# Altium schematic sheet Linelance_Schematic_page3.SchDoc
size 420 x 297 mm; Address1: Address1; Address2: Address2; Address3: Address3; Address4: Address4; DocumentNumber: АБВГ.123456.001 Э3; SheetNumber: 1; SheetTotal: 3; Scale: 1:1; DocumentType: Схема электрическая принципиальная; FirstReferrence: АБВГ.123456.001
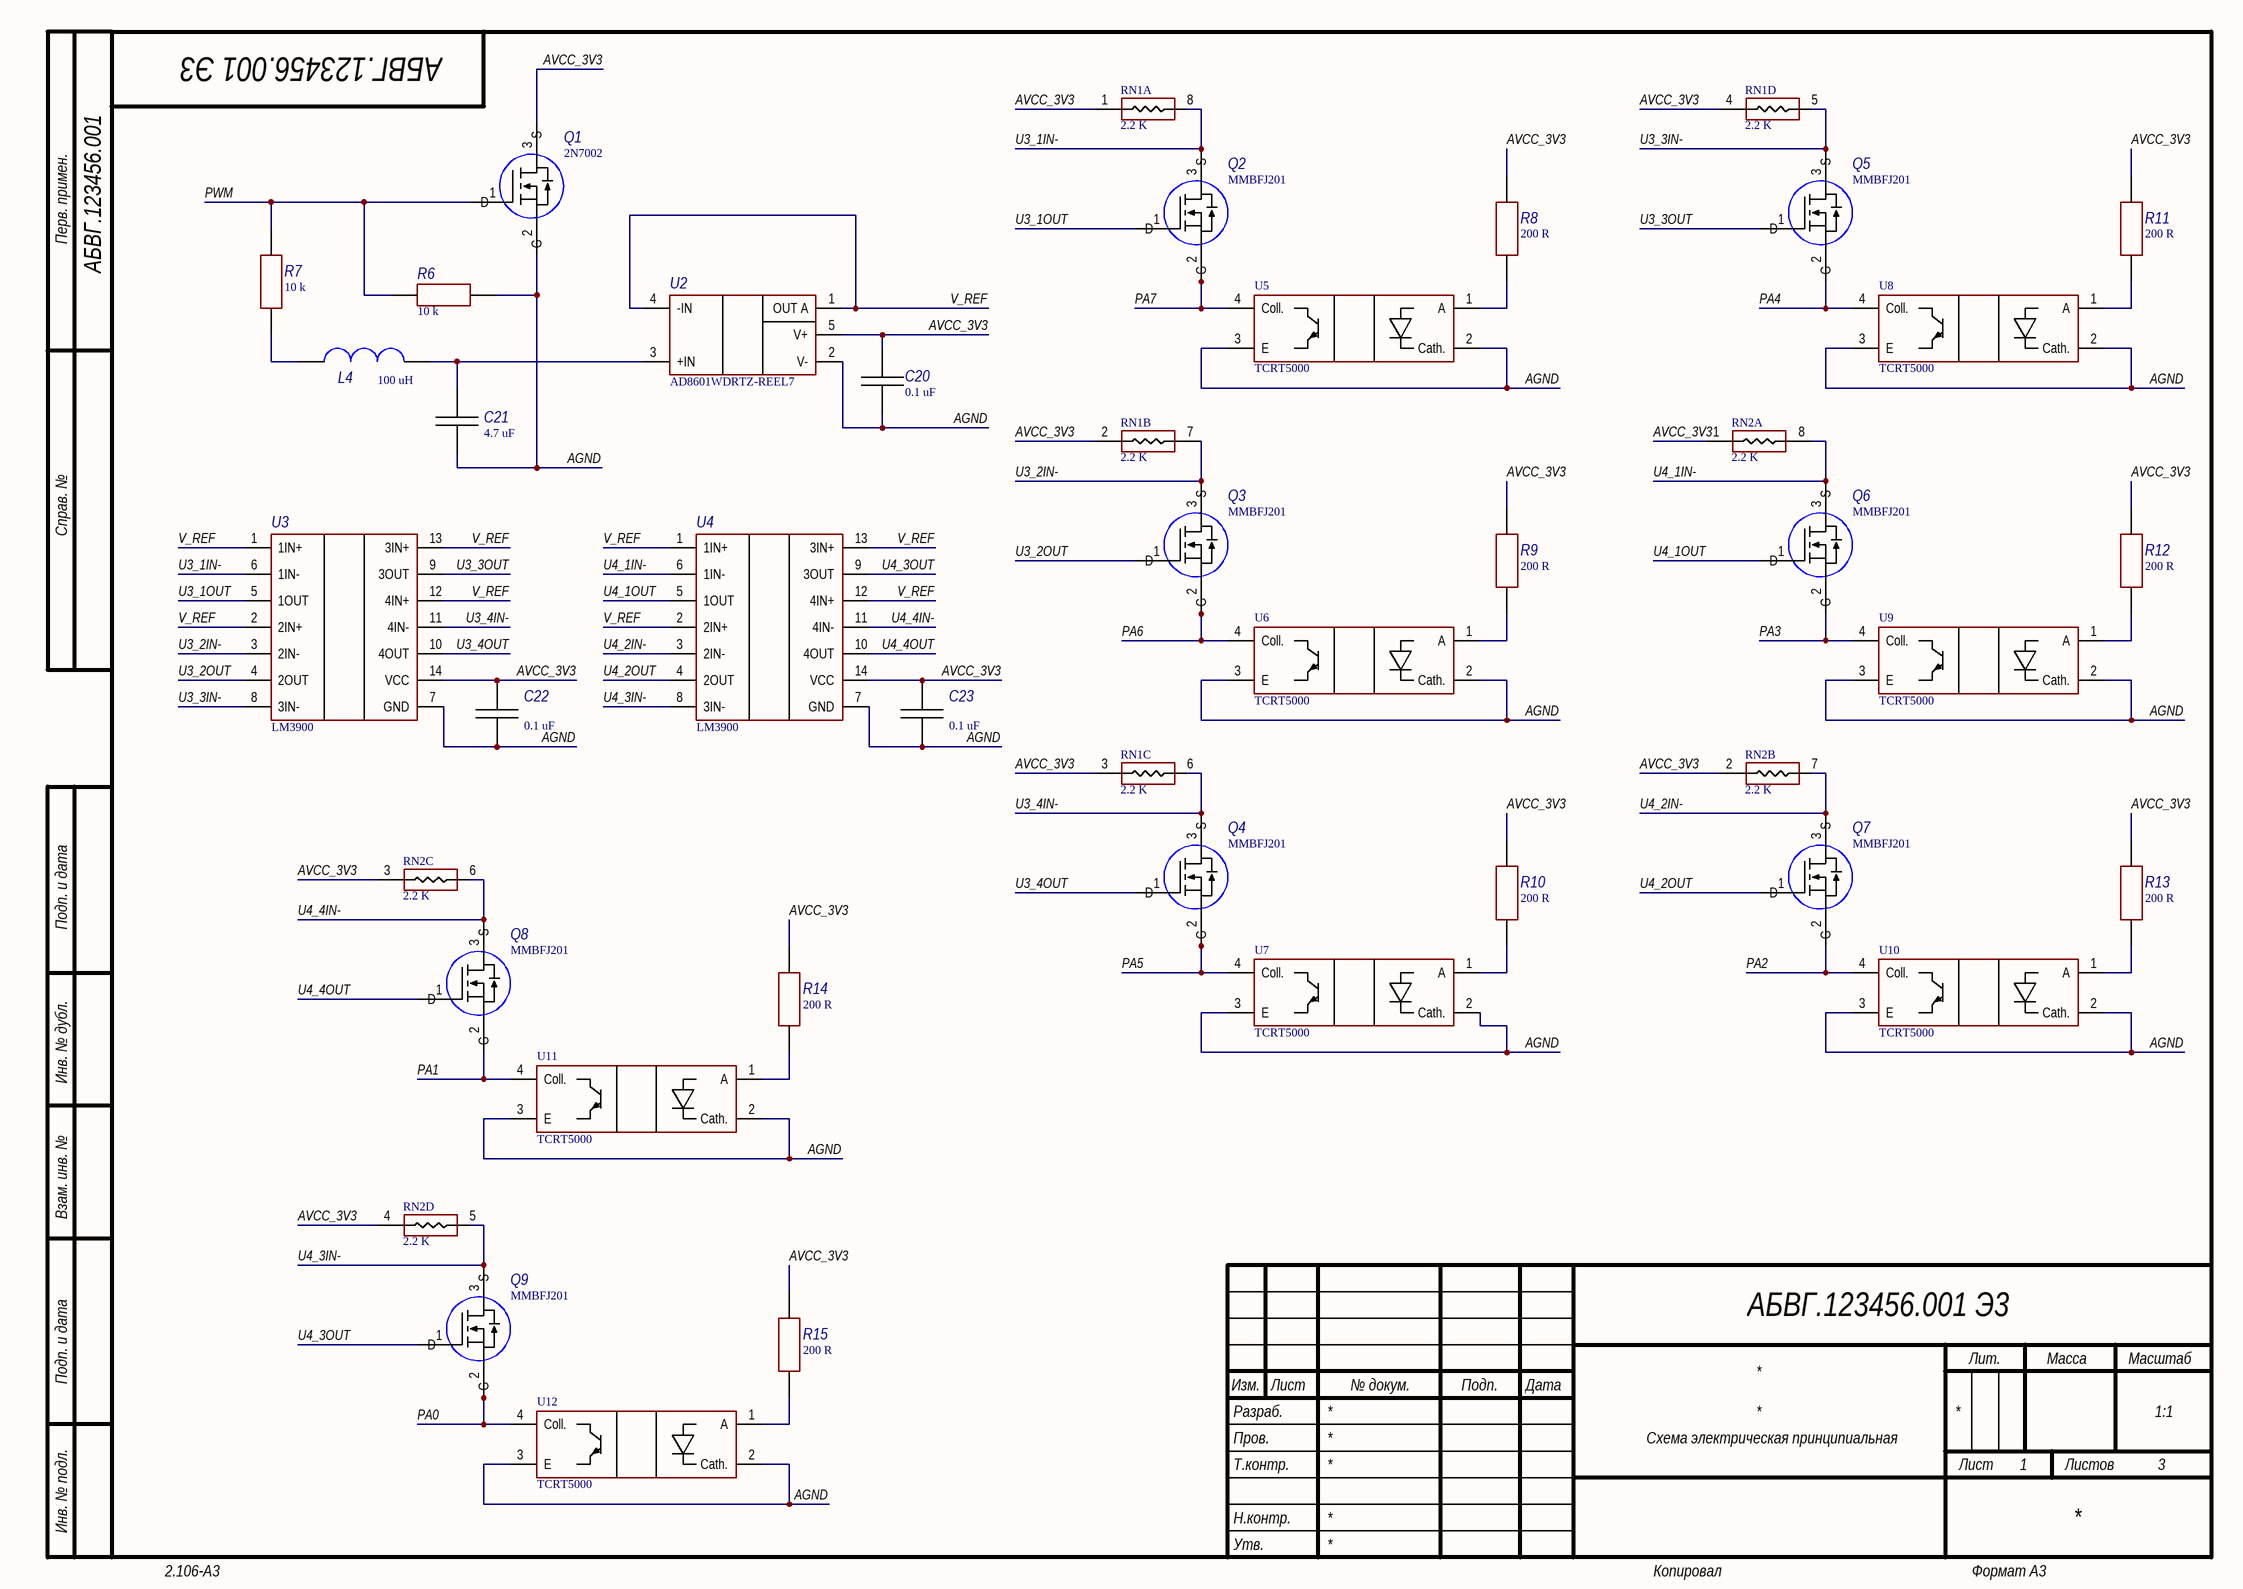
[diagram p0: Linelance_Schematic_page3.SchDoc]

## Parts
C20  0.1 uF  [C0603]
C21  4.7 uF  [C0603]
C22  0.1 uF  [C0603]
C23  0.1 uF  [C0603]
L4  100 uH  [IND1206]
Q1  2N7002  [SOT-23-3]
Q2  MMBFJ201  [SOT-23-3]
Q3  MMBFJ201  [SOT-23-3]
Q4  MMBFJ201  [SOT-23-3]
Q5  MMBFJ201  [SOT-23-3]
Q6  MMBFJ201  [SOT-23-3]
Q7  MMBFJ201  [SOT-23-3]
Q8  MMBFJ201  [SOT-23-3]
Q9  MMBFJ201  [SOT-23-3]
R6  10 k  [R0603]
R7  10 k  [R0603]
R8  200 R  [R0603]
R9  200 R  [R0603]
R10  200 R  [R0603]
R11  200 R  [R0603]
R12  200 R  [R0603]
R13  200 R  [R0603]
R14  200 R  [R0603]
R15  200 R  [R0603]
RN1  2.2 K  [RN_YC164-JR-072K2L]  (parts A,B,C,D of 4)  (graphical)
RN2  2.2 K  [RN_YC164-JR-072K2L]  (parts A,B,C,D of 4)  (graphical)
U2  AD8601WDRTZ-REEL7  [SOT-23-5]
U3  LM3900  [SOIC-14]
U4  LM3900  [SOIC-14]
U5  TCRT5000  [TCRT5000]
U6  TCRT5000  [TCRT5000]
U7  TCRT5000  [TCRT5000]
U8  TCRT5000  [TCRT5000]
U9  TCRT5000  [TCRT5000]
U10  TCRT5000  [TCRT5000]
U11  TCRT5000  [TCRT5000]
U12  TCRT5000  [TCRT5000]

## Nets
AGND: C20.2 C21.2 C22.2 C23.2 Q1.2(G) R6.2 U2.2(V-) U3.7(GND) U4.7(GND) U5.2(Cath.) U5.3(E) U6.2(Cath.) U6.3(E) U7.2(Cath.) U7.3(E) U8.2(Cath.) U8.3(E) U9.2(Cath.) U9.3(E) U10.2(Cath.) U10.3(E) U11.2(Cath.) U11.3(E) U12.2(Cath.) U12.3(E)
AVCC_3V3: C20.1 C22.1 C23.1 Q1.3(S) R8.2 R9.2 R10.2 R11.2 R12.2 R13.2 R14.2 R15.2 RN1.1 RN1.2 RN1.3 RN1.4 RN2.1 RN2.2 RN2.3 RN2.4 U2.5(V+) U3.14(VCC) U4.14(VCC)
PA0: Q9.2(G) U12.4(Coll.)
PA1: Q8.2(G) U11.4(Coll.)
PA2: Q7.2(G) U10.4(Coll.)
PA3: Q6.2(G) U9.4(Coll.)
PA4: Q5.2(G) U8.4(Coll.)
PA5: Q4.2(G) U7.4(Coll.)
PA6: Q3.2(G) U6.4(Coll.)
PA7: Q2.2(G) U5.4(Coll.)
PWM: Q1.1(D) R6.1 R7.2
U3_1IN-: Q2.3(S) RN1.8 U3.6(1IN-)
U3_1OUT: Q2.1(D) U3.5(1OUT)
U3_2IN-: Q3.3(S) RN1.7 U3.3(2IN-)
U3_2OUT: Q3.1(D) U3.4(2OUT)
U3_3IN-: Q5.3(S) RN1.5 U3.8(3IN-)
U3_3OUT: Q5.1(D) U3.9(3OUT)
U3_4IN-: Q4.3(S) RN1.6 U3.11(4IN-)
U3_4OUT: Q4.1(D) U3.10(4OUT)
U4_1IN-: Q6.3(S) RN2.8 U4.6(1IN-)
U4_1OUT: Q6.1(D) U4.5(1OUT)
U4_2IN-: Q7.3(S) RN2.7 U4.3(2IN-)
U4_2OUT: Q7.1(D) U4.4(2OUT)
U4_3IN-: Q9.3(S) RN2.5 U4.8(3IN-)
U4_3OUT: Q9.1(D) U4.9(3OUT)
U4_4IN-: Q8.3(S) RN2.6 U4.11(4IN-)
U4_4OUT: Q8.1(D) U4.10(4OUT)
V_REF: U2.1(OUT_A) U2.4(-IN) U3.1(1IN+) U3.2(2IN+) U3.12(4IN+) U3.13(3IN+) U4.1(1IN+) U4.2(2IN+) U4.12(4IN+) U4.13(3IN+)
NetC21_1: C21.1 L4.2 U2.3(+IN)
NetL4_1: L4.1 R7.1
NetR8_1: R8.1 U5.1(A)
NetR9_1: R9.1 U6.1(A)
NetR10_1: R10.1 U7.1(A)
NetR11_1: R11.1 U8.1(A)
NetR12_1: R12.1 U9.1(A)
NetR13_1: R13.1 U10.1(A)
NetR14_1: R14.1 U11.1(A)
NetR15_1: R15.1 U12.1(A)

## Notes on the sheet
- Перв. примен.
- Справ. №
- Подп. и дата
- Инв. № дубл.
- Взам. инв. №
- Разраб.
- Изм.
- Лист
- № докум.
- Подп.
- Дата
- Лит.
- Масса
- Масштаб
- Пров.
- Т.контр.
- Листов
- Инв. № подл.
- Утв.
- Н.контр.
- 2.106-A3
- Копировал
- Формат А3

## Library data of the parts
C20 C22 C23 = Capasitor: Manufacturer: Murata Manufacturing; Model: X7R 10% 50V; Value: 0.1 uF; Case: С0603; HelpURL: https://www.chipdip.by/product/grm188r71h104k
C21 = Capasitor: Manufacturer: Murata Manufacturing; Model: X5R 10% 10V; Value: 4.7 uF; Case: С0603; HelpURL: https://www.chipdip.by/product0/9000193550
L4 = Inductivity: Manufacturer: Murata Manufacturing; Model: *; HelpURL: https://www.chipdip.by/product/lqh31cn101k03l; Case: IND1206; Value: 100 uH
Q1 = 2N7002: MOSFET N-Channel 60V 115mA (Ta) 200mW (Ta) Surface Mount SOT-23 (TO-236AB); Manufacturer: Vishay; Model: MOSFET N-CH 60V 115MA SOT-23; Case: SOT-23-3; HelpURL: https://www.chipdip.by/product/2n7002k-t1-ge3-3
Q2-Q9 = MMBFJ201: JFET N-Channel 40V 350mW Surface Mount SOT-23-3; Manifacturer: ON Semiconductor; Case: SOT-23-3; HelpURL: https://www.chipdip.by/product/mmbfj201; Model: MMBFJ201
R6 R7 = Resistor: Manufacturer: YAGEO; Model: *; Value: 10 k; HelpURL: https://belchip.by/product/?selected_product=30985; Case: R0603
R8-R15 = Resistor: Model: *; Value: 200 R; HelpURL: https://www.chipdip.by/product0/9000079624; Case: R0603; Manufacturer: *
RN1 RN2 = Resistor Network: Manufacturer: Bourns; Model: *; Value: 2.2 K; HelpURL: https://www.chipdip.by/product/cat16-222j4; Case: SMD0603x4
U2 = AD8601: IC OPAMP GP 1 CIRCUIT SOT23-5; Manufacturer: Analog Devices Inc.; Model: AD8601WDRTZ-REEL7; HelpURL: https://www.chipdip.by/product/ad8601artz-reel7; Case: SOT-23-5
U3 U4 = LM3900: IC OPAMP GP 4 CIRCUIT 14SOIC; Manufacturer: Texas Instruments; Model: LM3900D; HelpURL: https://www.chipdip.by/product/lm3900d; Case: SOIC-14
U5-U12 = TCRT5000: SENSOR OPTO TRANS 15MM REFL PCB; Manufacturer: Vishay Semiconductor Opto Division; Model: TCRT5000; HelpURL: https://www.digikey.com/product-detail/en/vishay-semiconductor-opto-division/TCRT5000/751-1033-5-ND/1681167; Case: TCRT5000